# EAGLE design dsPIC (EAGLE 7.2.0)
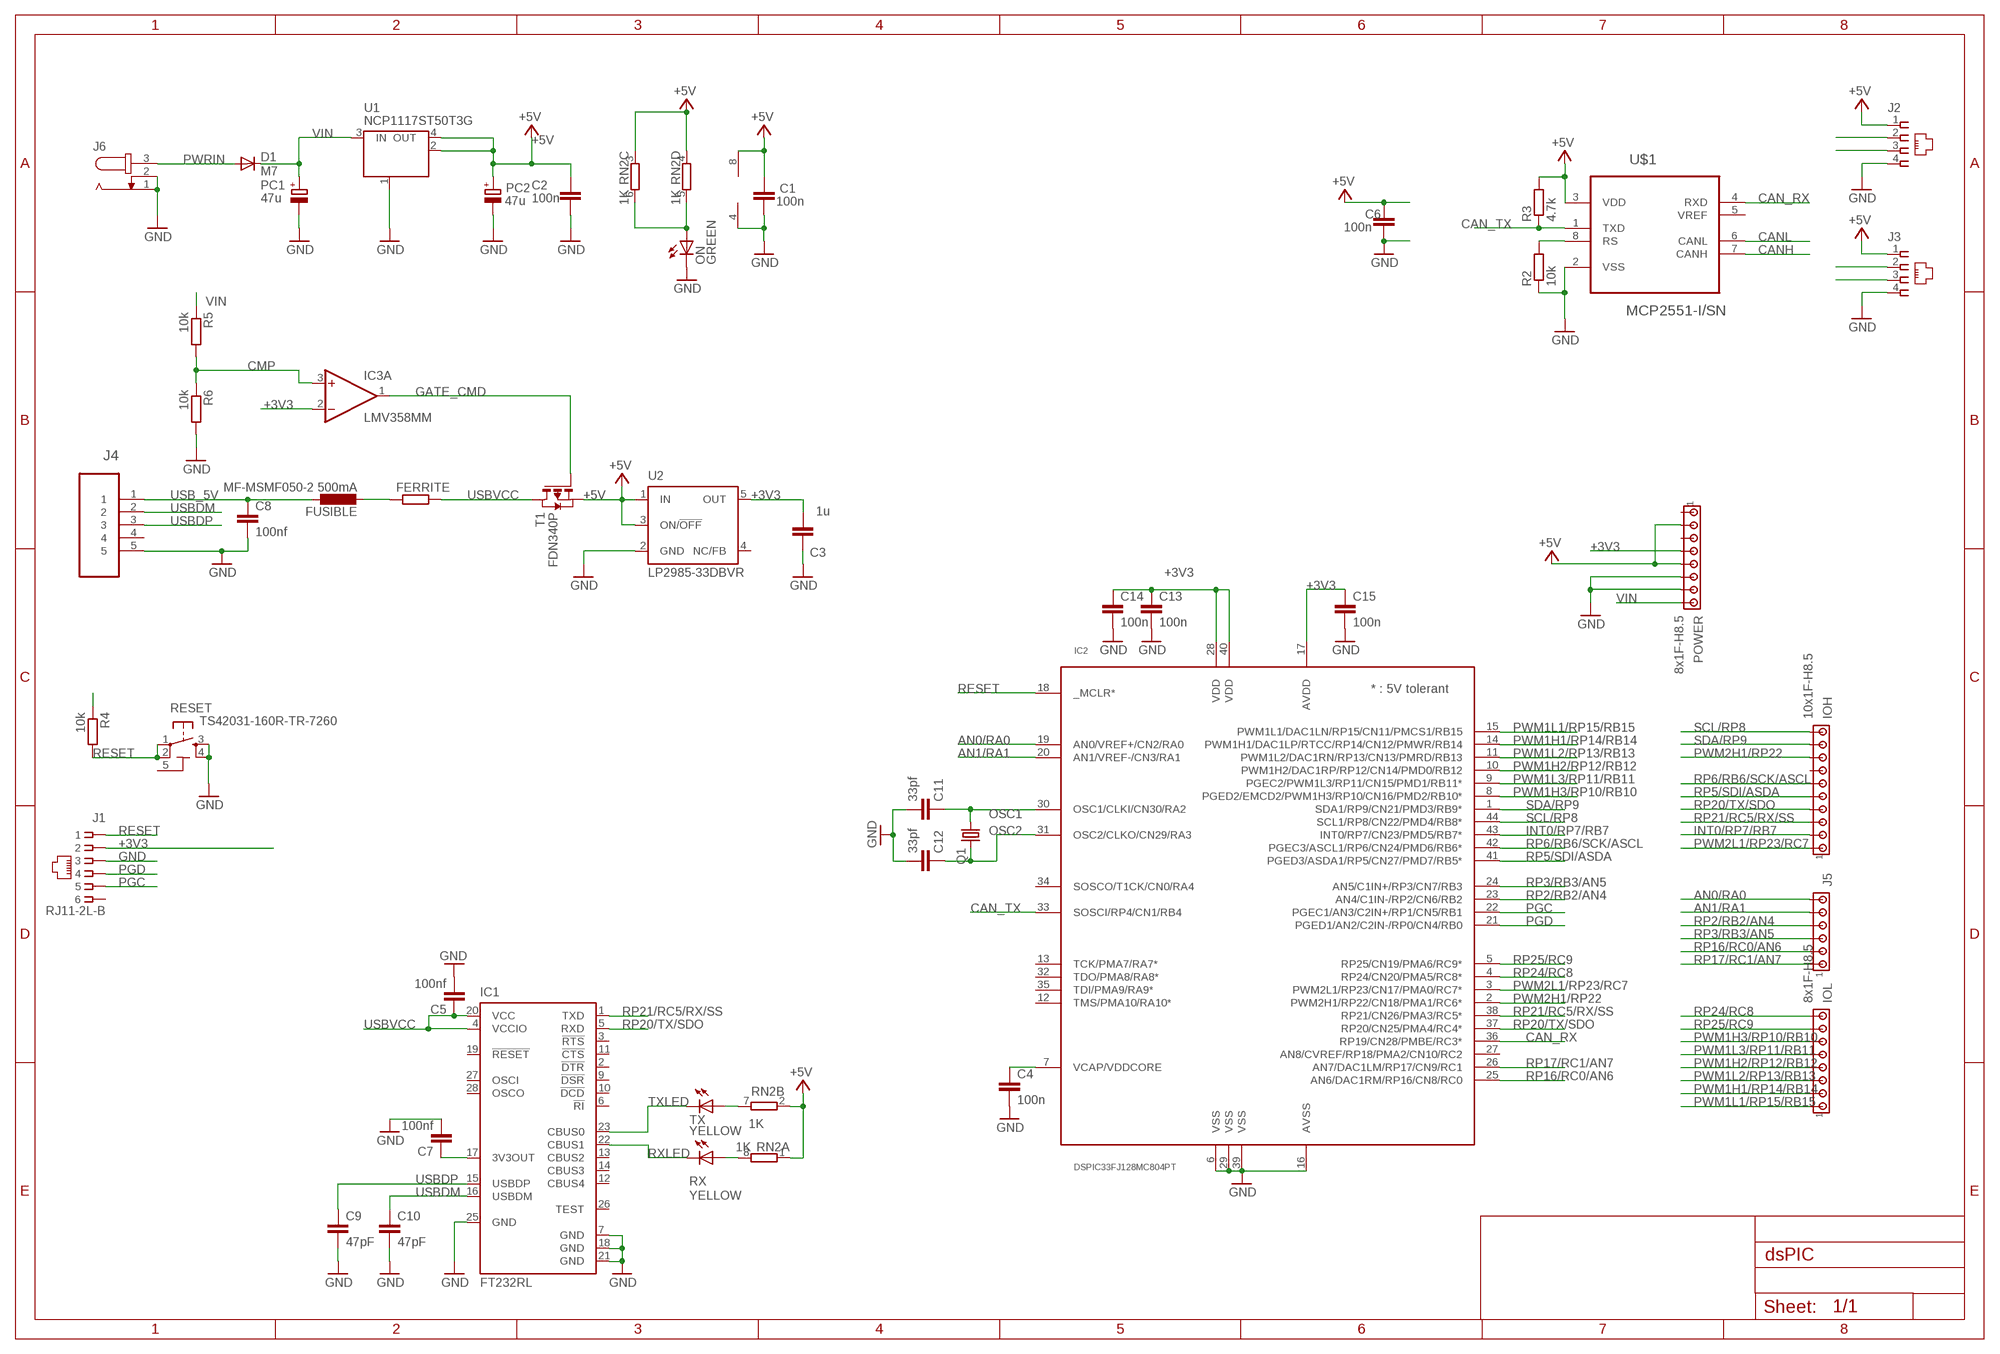
[diagram p0: schematic, sheet 1]

## Parts
C1  100n  C-EU0603-RND  [C0603-ROUND]
C2  100n  C-EU0603-RND  [C0603-ROUND]
C3  1u  C-EU0603-RND  [C0603-ROUND]
C4  100n  C-EUC0603K  [C0603K]
C5  100nf  C-EUC0603  [C0603]
C6  100n  C-EUC0603K  [C0603K]
C7  100nf  C-EUC0603  [C0603]
C8  100nf  C-EUC0603  [C0603]
C9  47pF  C-EUC0603  [C0603]
C10  47pF  C-EUC0603  [C0603]
C11  33pf  C-EUC0603  [C0603]
C12  33pf  C-EUC0603  [C0603]
C13  100n  C-EUC0603  [C0603]
C14  100n  C-EUC0603  [C0603]
C15  100n  C-EUC0603  [C0603]
D1  M7  DIODE-SMB  [SMB]
FERRITE  R-EU_M0805  [M0805]
FUSIBLE  MF-MSMF050-2 500mA  L-EUL1812  [L1812]
IC1  FT232RL  [SSOP28]
IC2  DSPIC33FJ128MC804PT  [TQFP44]
IC3  LMV358MM  [MSOP08]
IOH  10x1F-H8.5  MTA10-100  [10X10MTA]
IOL  8x1F-H8.5  MTA08-100  [10X08MTA]
J1  RJ11-2L-B  [RJ11-NO_SHIELD]
J2  520249-2  [520249-2]
J3  520249-2  [520249-2]
J4  47346-0001  [MOLEX_47346-0001]
J5  MTA06-100  [10X06MTA]
J6  JACK-PLUG0  [SPC4077]
ON  GREEN  LEDCHIP-LED0805  [CHIP-LED0805]
PC1  47u  CPOL-EUD  [PANASONIC_D]
PC2  47u  CPOL-EUD  [PANASONIC_D]
POWER  8x1F-H8.5  MTA08-100  [10X08MTA]
Q1  CRYSTALSM49  [SM49]
R2  10k  R-EU_R0805  [R0805]
R3  4.7k  R-EU_R0805  [R0805]
R4  10k  R-EU_R0805  [R0805]
R5  10k  R-EU_R0805  [R0805]
R6  10k  R-EU_R0805  [R0805]
RESET  TS42031-160R-TR-7260  TS42  [TS42]
RN2  1K  4R-NCAY16  [CAY16]
RX  YELLOW  LEDCHIP-LED0805  [CHIP-LED0805]
T1  FDN340P  PMOSSOT23  [SOT-23]
TX  YELLOW  LEDCHIP-LED0805  [CHIP-LED0805]
U1  NCP1117ST50T3G  MC33269ST-3.3T3  [SOT223]
U2  LP2985-33DBVR  LP2985-XXDBVR33  [SOT23-DBV]
U$1  MCP2551-I/SN  [SOIC127P600X175-8N]

## Nets
+3V3: C3.2 C13.1 C14.1 C15.1 IC2.17(AVDD) IC2.28(VDD) IC2.40(VDD) IC3.2(A:-IN) J1.2 POWER.4 R4.1 U2.5(OUT)
+5V: C1.2 C2.2 C6.2 IC3.8(P:V+) J2.1 J3.1 PC2.+ POWER.2 POWER.5 R3.2 RN2.1 RN2.2 RN2.3 RN2.4 T1.2(S) U1.2(OUT) U1.4(OUT) U2.1(IN) U2.3(ON/!OFF) U$1.3(VDD)
AN0/RA0: IC2.19(AN0/VREF+/CN2/RA0) J5.1
AN1/RA1: IC2.20(AN1/VREF-/CN3/RA1) J5.2
CAN_RX: IC2.36(RP19/CN28/PMBE/RC3*) U$1.4(RXD)
CAN_TX: IC2.33(SOSCI/RP4/CN1/RB4) R3.1 U$1.1(TXD)
CANH: J2.2 J3.2 U$1.7(CANH)
CANL: J2.3 J3.3 U$1.6(CANL)
CMP: IC3.3(A:+IN) R5.2 R6.1
GATE_CMD: IC3.1(A:OUT) T1.3(G)
GND: C1.1 C2.1 C3.1 C4.2 C5.2 C6.1 C7.2 C8.2 C9.2 C10.2 C11.2 C12.2 C13.2 C14.2 C15.2 IC1.7(GND) IC1.18(GND) IC1.21(GND) IC1.25(GND) IC2.6(VSS) IC2.16(AVSS) IC2.29(VSS) IC2.39(VSS) IC3.4(P:V-) J1.3 J2.4 J3.4 J4.5 J6.1 J6.2 ON.C PC1.- PC2.- POWER.6 POWER.7 R2.1 R6.2 RESET.3 RESET.4 U1.1(GND/ADJ) U2.2(GND) U$1.2(VSS)
INT0/RP7/RB7: IC2.43(INT0/RP7/CN23/PMD5/RB7*) IOH.2
N$1: RN2.7 TX.A
N$2: C7.1 IC1.17(3V3OUT)
N$3: ON.A RN2.5 RN2.6
N$4: FERRITE.1 FUSIBLE.2
N$5: C4.1 IC2.7(VCAP/VDDCORE)
N$10: RN2.8 RX.A
N$11: R2.2 U$1.8(RS)
OSC1: C11.1 IC2.30(OSC1/CLKI/CN30/RA2) Q1.1
OSC2: C12.1 IC2.31(OSC2/CLKO/CN29/RA3) Q1.2
PGC: IC2.22(PGEC1/AN3/C2IN+/RP1/CN5/RB1) J1.5
PGD: IC2.21(PGED1/AN2/C2IN-/RP0/CN4/RB0) J1.4
PWM1H1/RP14/RB14: IC2.14(PWM1H1/DAC1LP/RTCC/RP14/CN12/PMWR/RB14) IOL.2
PWM1H2/RP12/RB12: IC2.10(PWM1H2/DAC1RP/RP12/CN14/PMD0/RB12) IOL.4
PWM1H3/RP10/RB10: IC2.8(PGED2/EMCD2/PWM1H3/RP10/CN16/PMD2/RB10*) IOL.6
PWM1L1/RP15/RB15: IC2.15(PWM1L1/DAC1LN/RP15/CN11/PMCS1/RB15) IOL.1
PWM1L2/RP13/RB13: IC2.11(PWM1L2/DAC1RN/RP13/CN13/PMRD/RB13) IOL.3
PWM1L3/RP11/RB11: IC2.9(PGEC2/PWM1L3/RP11/CN15/PMD1/RB11*) IOL.5
PWM2H1/RP22: IC2.2(PWM2H1/RP22/CN18/PMA1/RC6*) IOH.8
PWM2L1/RP23/RC7: IC2.3(PWM2L1/RP23/CN17/PMA0/RC7*) IOH.1
PWRIN: D1.A J6.3
RESET: IC2.18(_MCLR*) J1.1 R4.2 RESET.1 RESET.2
RP2/RB2/AN4: IC2.23(AN4/C1IN-/RP2/CN6/RB2) J5.3
RP3/RB3/AN5: IC2.24(AN5/C1IN+/RP3/CN7/RB3) J5.4
RP5/SDI/ASDA: IC2.41(PGED3/ASDA1/RP5/CN27/PMD7/RB5*) IOH.5
RP6/RB6/SCK/ASCL: IC2.42(PGEC3/ASCL1/RP6/CN24/PMD6/RB6*) IOH.6
RP16/RC0/AN6: IC2.25(AN6/DAC1RM/RP16/CN8/RC0) J5.5
RP17/RC1/AN7: IC2.26(AN7/DAC1LM/RP17/CN9/RC1) J5.6
RP20/TX/SDO: IC1.5(RXD) IC2.37(RP20/CN25/PMA4/RC4*) IOH.4
RP21/RC5/RX/SS: IC1.1(TXD) IC2.38(RP21/CN26/PMA3/RC5*) IOH.3
RP24/RC8: IC2.4(RP24/CN20/PMA5/RC8*) IOL.8
RP25/RC9: IC2.5(RP25/CN19/PMA6/RC9*) IOL.7
RXLED: IC1.22(CBUS1) RX.C
SCL/RP8: IC2.44(SCL1/RP8/CN22/PMD4/RB8*) IOH.10
SDA/RP9: IC2.1(SDA1/RP9/CN21/PMD3/RB9*) IOH.9
TXLED: IC1.23(CBUS0) TX.C
USB_5V: C8.1 FUSIBLE.1 J4.1
USBDM: C10.1 IC1.16(USBDM) J4.2
USBDP: C9.1 IC1.15(USBDP) J4.3
USBVCC: C5.1 FERRITE.2 IC1.4(VCCIO) IC1.20(VCC) T1.1(D)
VIN: D1.C PC1.+ POWER.8 R5.1 U1.3(IN)
Unconnected: IC1.2(!DTR) IC1.3(!RTS) IC1.6(!RI) IC1.9(!DSR) IC1.10(!DCD) IC1.11(!CTS) IC1.12(CBUS4) IC1.13(CBUS2) IC1.14(CBUS3) IC1.19(!RESET) IC1.26(TEST) IC1.27(OSCI) IC1.28(OSCO) IC2.12(TMS/PMA10/RA10*) IC2.13(TCK/PMA7/RA7*) IC2.27(AN8/CVREF/RP18/PMA2/CN10/RC2) IC2.32(TDO/PMA8/RA8*) IC2.34(SOSCO/T1CK/CN0/RA4) IC2.35(TDI/PMA9/RA9*) IC3.5(B:+IN) IC3.6(B:-IN) IC3.7(B:OUT) IOH.7 J1.6 J4.4 POWER.1 POWER.3 U2.4(NC/FB) U$1.5(VREF)

## Power pins joined to a net without a drawn wire
5-GND: RESET.5(5-GND)

## Library data of the parts
C1 C2 C4 C6 = SmartPrj:C-EU: CAPACITOR, European symbol; OC_FARNELL: 2210925
C3 = SmartPrj:C-EU: CAPACITOR, European symbol; OC_FARNELL: 2346901
C5 C7 C8 C13-C15 = LibPerso:C-EU: CAPACITOR, European symbol; OC_FARNELL: 2210925
C9 C10 = LibPerso:C-EU: CAPACITOR, European symbol; OC_FARNELL: 1740601
C11 C12 = LibPerso:C-EU: CAPACITOR, European symbol; OC_FARNELL: 1740598
D1 = diode:DIODE-: DIODE; OC_FARNELL: 1858651
FERRITE = LibPerso:R-EU_: RESISTOR, European symbol; OC_FARNELL: 2292459
FUSIBLE = rcl:L-EU: INDUCTOR, European symbol; OC_FARNELL: 2396061
IC1 = ftdichip:FT232R: Source: http://www.ftdichip.com/Documents/DataSheets/DS_FT232R_v104.pdf; MPN: FT232RL; OC_FARNELL: 1146032; OC_NEWARK: 91K9918
IC2 = microchip-dspic33:DSPIC33F*04
IC3 = linear:LMV358?*: Dual General Purpose, Low Voltage, Rail-to-Rail Output Operational Amplifiers Source: http://www.national.com/mpf/LM/LMV321.html http://www.national.com/dt/lmv_qual.pdf
IOH = LibPerso:MTA10-100: AMP connector; OC_FARNELL: 1593464
IOL POWER = LibPerso:MTA08-100: AMP connector; OC_FARNELL: 1593463
J1 = LibPerso:RJ11: CORCOM Modular RJ Jacks No Shield Source: www.tycoelectronics.com .. ENG_DS_1654001_1099_RJ_L_0507.pdf; MF: TYCO ELECTRONICS; MPN: RJ11-2L-B; OC_FARNELL: 1393306; OC_NEWARK: 83F4463
J2 J3 = LibPerso:520249-2: AMP connector; OC_FARNELL: 1137972; OC_RS: 477-359
J4 = Molex-47346-0001:47346-0001: CONN RCPT 5POS MICRO USB R/A SMD; MPN: 47346-0001; OC_FARNELL: 1568026; OC_NEWARK: 47M0505; PACKAGE: 5 POS MICRO USB R/A; SUPPLIER: MOLEX
J5 = LibPerso:MTA06-100: AMP connector; OC_FARNELL: 1593462
J6 = LibPerso:JACK-PLUG: DC POWER JACK Power Jack, DC, Right Angle, Through Hole, Rated 5A at 16VDC, PC Terminals Distributor: Farnell (www.Farnell.de) Drawing: 84N1161.pdf / 84N1162.pdf Manufacturer: SPC Technology (www.spctechnology.com) Type: SPC4077 / SPC 4078; OC_FARNELL: 1737246; OC_NEWARK: unknown
ON = led:LED: LED OSRAM: - CHIPLED LG R971, LG N971, LY N971, LG Q971, LY Q971, LO R971, LY R971 LH N974, LH R974 LS Q976, LO Q976, LY Q976 LO Q996 - Hyper CHIPLED LW Q18S LB Q993, LB Q99A, LB R99A - SideLED LS A670, LO A670, LY A670, LG A670, LP A670 LB A673, LV A673, LT A673, LW A673 LH A674 LY A675 LS A676, LA A676, LO A676, LY A676, LW A676 LS A679, LY A679, LG A679 - Hyper Micro SIDELED® LS Y876, LA Y876, LO Y876, LY Y876 LT Y87S - SmartLED LW L88C, LW L88S LB L89C, LB L89S, LG L890 LS L89K, LO L89K, LY L89K LS L896, LA L896, LO L896, LY L896 - TOPLED LS T670, LO T670, LY T670, LG T670, LP T670 LSG T670, LSP T670, LSY T670, LOP T670, LYG T670 LG T671, LOG T671, LSG T671 LB T673, LV T673, LT T673, LW T673 LH T674 LS T676, LA T676, LO T676, LY T676, LB T676, LH T676, LSB T676, LW T676 LB T67C, LV T67C, LT T67C, LS T67K, LO T67K, LY T67K, LW E67C LS E67B, LA E67B, LO E67B, LY E67B, LB E67C, LV E67C, LT E67C LW T67C LS T679, LY T679, LG T679 LS T770, LO T770, LY T770, LG T770, LP T770 LB T773, LV T773, LT T773, LW T773 LH T774 LS E675, LA E675, LY E675, LS T675 LS T776, LA T776, LO T776, LY T776, LB T776 LHGB T686 LT T68C, LB T68C - Hyper Mini TOPLED® LB M676 - Mini TOPLED Santana® LG M470 LS M47K, LO M47K, LY M47K Source: http://www.osram.convergy.de LUXEON: - LUMILED® LXK2-PW12-R00, LXK2-PW12-S00, LXK2-PW14-U00, LXK2-PW14-V00 LXK2-PM12-R00, LXK2-PM12-S00, LXK2-PM14-U00 LXK2-PE12-Q00, LXK2-PE12-R00, LXK2-PE12-S00, LXK2-PE14-T00, LXK2-PE14-U00 LXK2-PB12-K00, LXK2-PB12-L00, LXK2-PB12-M00, LXK2-PB14-N00, LXK2-PB14-P00, LXK2-PB14-Q00 LXK2-PR12-L00, LXK2-PR12-M00, LXK2-PR14-Q00, LXK2-PR14-R00 LXK2-PD12-Q00, LXK2-PD12-R00, LXK2-PD12-S00 LXK2-PH12-R00, LXK2-PH12-S00 LXK2-PL12-P00, LXK2-PL12-Q00, LXK2-PL12-R00 Source: www.luxeon.com KINGBRIGHT: KA-3528ASYC Source: www.kingbright.com; OC_FARNELL: 8529906
PC1 PC2 = rcl:CPOL-EU: POLARIZED CAPACITOR, European symbol; OC_FARNELL: 1850100
Q1 = crystal:CRYSTAL: CRYSTAL; OC_FARNELL: 1842332; OC_NEWARK: unknown
R2-R6 = LibPerso:R-EU_: RESISTOR, European symbol
RESET = SmartPrj:TS42: TS42 Dongnan Electronics Tact switch VDC 12V - 50mA; OC_FARNELL: 2060823
RN2 = resistor-dil:4R-N: Array Chip Resistor Source: RS Component / Phycomp; OC_FARNELL: 2352761; OC_NEWARK: none
RX TX = led:LED: LED OSRAM: - CHIPLED LG R971, LG N971, LY N971, LG Q971, LY Q971, LO R971, LY R971 LH N974, LH R974 LS Q976, LO Q976, LY Q976 LO Q996 - Hyper CHIPLED LW Q18S LB Q993, LB Q99A, LB R99A - SideLED LS A670, LO A670, LY A670, LG A670, LP A670 LB A673, LV A673, LT A673, LW A673 LH A674 LY A675 LS A676, LA A676, LO A676, LY A676, LW A676 LS A679, LY A679, LG A679 - Hyper Micro SIDELED® LS Y876, LA Y876, LO Y876, LY Y876 LT Y87S - SmartLED LW L88C, LW L88S LB L89C, LB L89S, LG L890 LS L89K, LO L89K, LY L89K LS L896, LA L896, LO L896, LY L896 - TOPLED LS T670, LO T670, LY T670, LG T670, LP T670 LSG T670, LSP T670, LSY T670, LOP T670, LYG T670 LG T671, LOG T671, LSG T671 LB T673, LV T673, LT T673, LW T673 LH T674 LS T676, LA T676, LO T676, LY T676, LB T676, LH T676, LSB T676, LW T676 LB T67C, LV T67C, LT T67C, LS T67K, LO T67K, LY T67K, LW E67C LS E67B, LA E67B, LO E67B, LY E67B, LB E67C, LV E67C, LT E67C LW T67C LS T679, LY T679, LG T679 LS T770, LO T770, LY T770, LG T770, LP T770 LB T773, LV T773, LT T773, LW T773 LH T774 LS E675, LA E675, LY E675, LS T675 LS T776, LA T776, LO T776, LY T776, LB T776 LHGB T686 LT T68C, LB T68C - Hyper Mini TOPLED® LB M676 - Mini TOPLED Santana® LG M470 LS M47K, LO M47K, LY M47K Source: http://www.osram.convergy.de LUXEON: - LUMILED® LXK2-PW12-R00, LXK2-PW12-S00, LXK2-PW14-U00, LXK2-PW14-V00 LXK2-PM12-R00, LXK2-PM12-S00, LXK2-PM14-U00 LXK2-PE12-Q00, LXK2-PE12-R00, LXK2-PE12-S00, LXK2-PE14-T00, LXK2-PE14-U00 LXK2-PB12-K00, LXK2-PB12-L00, LXK2-PB12-M00, LXK2-PB14-N00, LXK2-PB14-P00, LXK2-PB14-Q00 LXK2-PR12-L00, LXK2-PR12-M00, LXK2-PR14-Q00, LXK2-PR14-R00 LXK2-PD12-Q00, LXK2-PD12-R00, LXK2-PD12-S00 LXK2-PH12-R00, LXK2-PH12-S00 LXK2-PL12-P00, LXK2-PL12-Q00, LXK2-PL12-R00 Source: www.luxeon.com KINGBRIGHT: KA-3528ASYC Source: www.kingbright.com; OC_FARNELL: 1686073
T1 = zetex:PMOSSOT23: MOS FET; OC_FARNELL: 9846310; OC_NEWARK: none
U1 = linear:MC33269ST*: Adjustable Output Low Dropout Voltage Regulator 800 mA Source: http://www.onsemi.com/pub/Collateral/MC33269-D.PDF; OC_FARNELL: 2112617
U2 = SmartPrj:LP2985-XXDBVR: ULTRALOW-POWER 50-mA LOW-DROPOUT LINEAR REGULATORS 50-mA Low-Dropout Regulator Source: http://focus.ti.com/lit/ds/symlink/tps77001.pdf; OC_FARNELL: 2395925
U$1 = LibPerso:MCP2551-I/SN: High-Speed CAN Transceiver; MPN: MCP2551-I/SN; OC_FARNELL: 9758569; OC_NEWARK: 69K7604; PACKAGE: SOIC-8; SUPPLIER: Microchip

## Net classes
0 default: width 0.254 mm, clearance 0.254 mm
1 power: width 0.61 mm, drill 0.61 mm, clearance 0.254 mm
2 gnd: width 0.305 mm, drill 0.559 mm, clearance 0.254 mm
3 usbvcc: width 0.508 mm, drill 0.61 mm, clearance 0.254 mm
4 aref: width 0.406 mm, drill 0.61 mm, clearance 0.254 mm

## Board
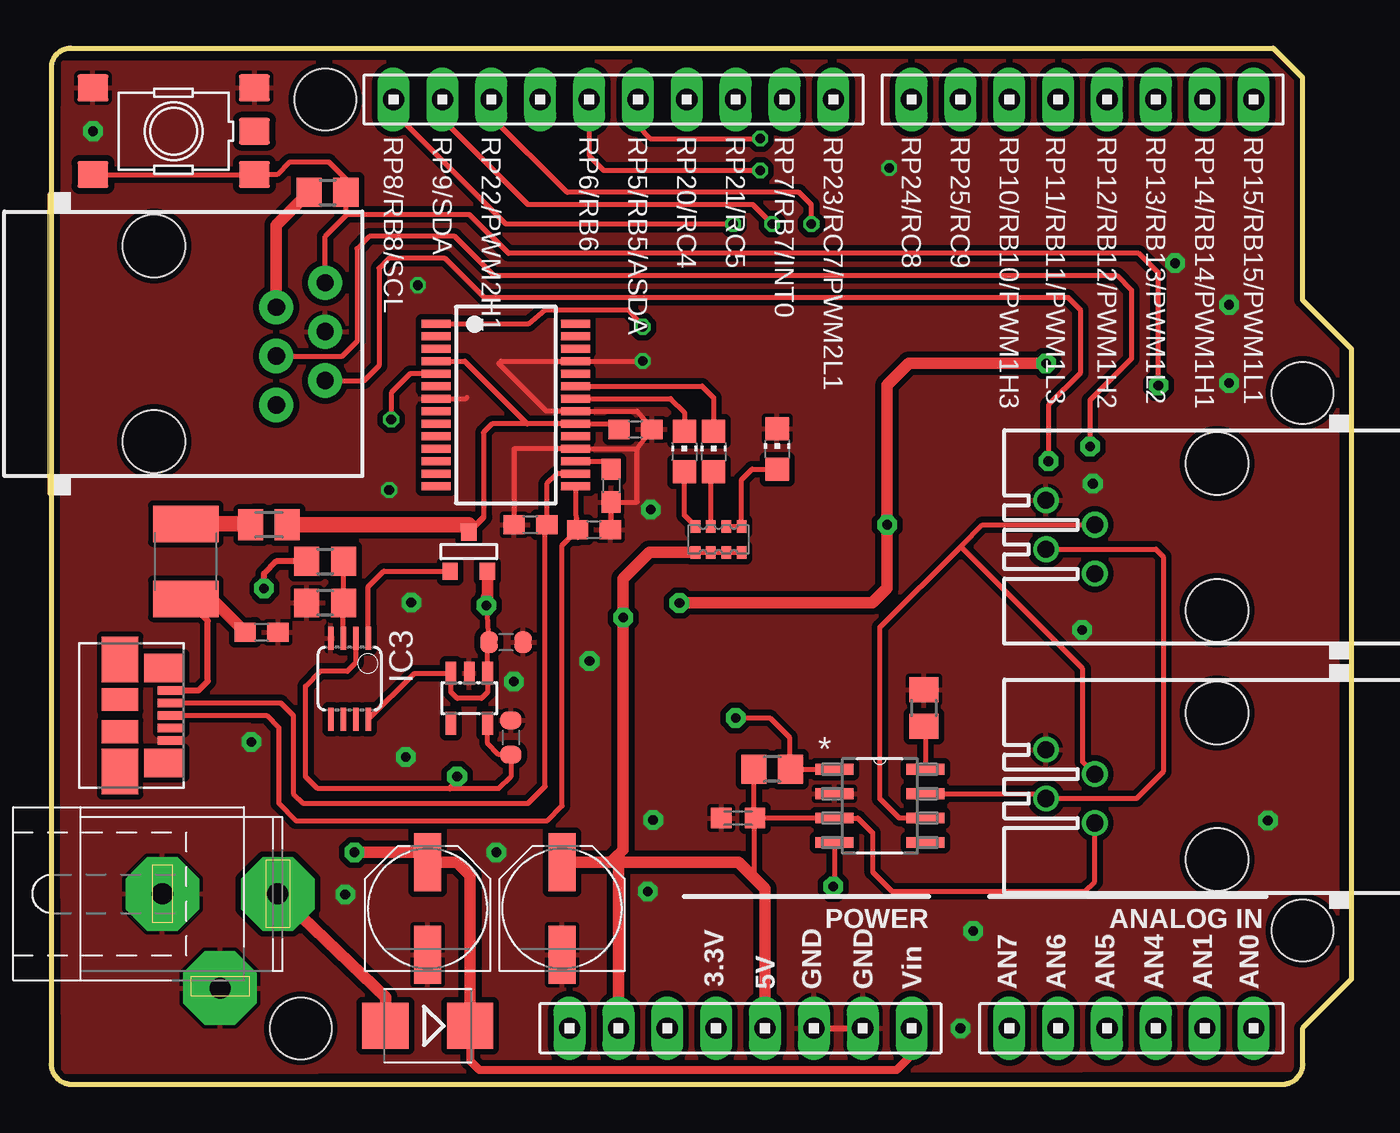
[diagram p1: board, top side]
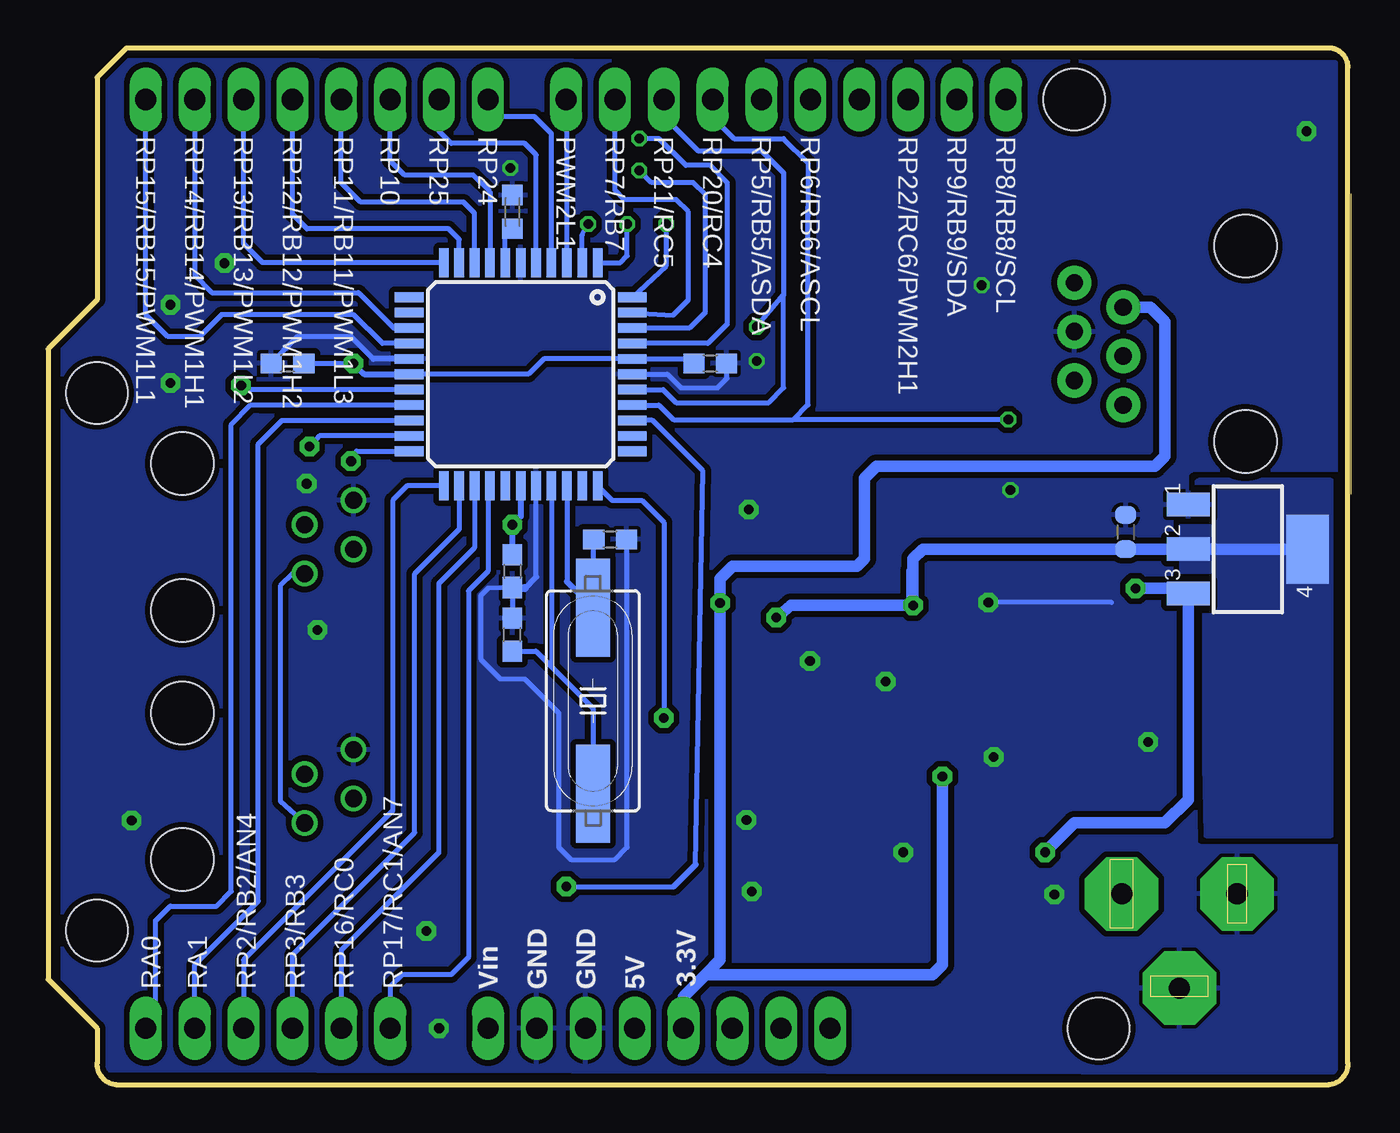
[diagram p2: board, bottom side, seen from below]

Size 67.57 x 53.85 mm. Coordinates in mm from the lower left corner, seen from the top.
Outline: 63.5,53.85 65.03,52.32 65.03,40.77 67.57,38.23 67.57,5.46 65.03,2.92 65.03,1.13 arc-90 64.03,0 1,0 arc-90 0,1.13 0,52.85 arc-90 1,53.85 63.5,53.85
Copper layers (1*16): Top 0.018mm / dielectric 1.55mm / Bottom 0.018mm
Design rules "eC_2Layer_PClass6_BaseCopperO18_eCDefault": minimum track width 0.15mm, minimum drill 0.35mm, track to track 0.15mm, track to pad 0.15mm, pad to pad 0.15mm, via to via 0.15mm, smd to smd 0mil, copper to edge 0.25mm, drill to drill 0.35mm, minimum pad ring 0.175mm, minimum via ring 0.125mm, stop-mask expansion 0mil, vias tented up to drill 0.45mm, thermal gap 0.2mm
Holes 3.2 mm at 65.03,35.94 65.03,8 14.23,51.18 12.96,2.92
vRestrict: area 47.8,10.3 to 48.4,10.8; area 50.3,10.2 to 50.8,11

### Footprints (pad centres in the part's own frame; a part is rotated, then mirrored left to right if it is on the bottom)
C0603-ROUND = smd 0.898 x 1.1: 1 -0.889,0; 2 0.889,0
C0603K = smd 1.05 x 1.08: 1 -0.875,0; 2 0.875,0
C0603 = smd 1.1 x 1: 1 -0.85,0; 2 0.85,0
SMB = smd 2.4 x 2.4: A 2.2,0; C -2.2,0
M0805 = smd 1.3 x 1.6: 1 -0.95,0; 2 0.95,0
L1812 = smd 1.9 x 3.4: 1 -1.95,0; 2 1.95,0
SSOP28 = smd 0.4 x 1.5: 1 -4.225,-3.625; 2 -3.575,-3.625; 3 -2.925,-3.625; 4 -2.275,-3.625; 5 -1.625,-3.625; 6 -0.975,-3.625; 7 -0.325,-3.625; 8 0.325,-3.625; 9 0.975,-3.625; 10 1.625,-3.625; 11 2.275,-3.625; 12 2.925,-3.625; 13 3.575,-3.625; 14 4.225,-3.625; 15 4.225,3.625; 16 3.575,3.625; 17 2.925,3.625; 18 2.275,3.625; 19 1.625,3.625; 20 0.975,3.625; 21 0.325,3.625; 22 -0.325,3.625; 23 -0.975,3.625; 24 -1.625,3.625; 25 -2.275,3.625; 26 -2.925,3.625; 27 -3.575,3.625; 28 -4.225,3.625
TQFP44 = smd 1.5 x 0.5: 1 -5.8,4; 2 -5.8,3.2; 3 -5.8,2.4; 4 -5.8,1.6; 5 -5.8,0.8; 6 -5.8,0; 7 -5.8,-0.8; 8 -5.8,-1.6; 9 -5.8,-2.4; 10 -5.8,-3.2; 11 -5.8,-4; 23 5.8,-4; 24 5.8,-3.2; 25 5.8,-2.4; 26 5.8,-1.6; 27 5.8,-0.8; 28 5.8,0; 29 5.8,0.8; 30 5.8,1.6; 31 5.8,2.4; 32 5.8,3.2; 33 5.8,4 | smd 0.5 x 1.5: 12 -4,-5.8; 13 -3.2,-5.8; 14 -2.4,-5.8; 15 -1.6,-5.8; 16 -0.8,-5.8; 17 0,-5.8; 18 0.8,-5.8; 19 1.6,-5.8; 20 2.4,-5.8; 21 3.2,-5.8; 22 4,-5.8; 34 4,5.8; 35 3.2,5.8; 36 2.4,5.8; 37 1.6,5.8; 38 0.8,5.8; 39 0,5.8; 40 -0.8,5.8; 41 -1.6,5.8; 42 -2.4,5.8; 43 -3.2,5.8; 44 -4,5.8
MSOP08 = smd 0.3 x 1.2: 1 -0.976,-2.113; 2 -0.326,-2.113; 3 0.324,-2.113; 4 0.974,-2.113; 5 0.974,2.112; 6 0.324,2.112; 7 -0.326,2.112; 8 -0.976,2.112
10X10MTA = drill 1.1 long: 1 11.43,0; 2 8.89,0; 3 6.35,0; 4 3.81,0; 5 1.27,0; 6 -1.27,0; 7 -3.81,0; 8 -6.35,0; 9 -8.89,0; 10 -11.43,0
10X08MTA = drill 1.1 long: 1 8.89,0; 2 6.35,0; 3 3.81,0; 4 1.27,0; 5 -1.27,0; 6 -3.81,0; 7 -6.35,0; 8 -8.89,0
RJ11-NO_SHIELD = drill 0.9 pad 1.778: 1 -3.175,8.89; 2 -1.905,6.35; 3 -0.635,8.89; 4 0.635,6.35; 5 1.905,8.89; 6 3.175,6.35 | hole 3.251: -5.08,0; 5.08,0
520249-2 = drill 0.889: 1 -1.905,6.35; 2 -0.635,8.89; 3 0.635,6.35; 4 1.905,8.89 | hole 3.251: -3.81,0; 3.81,0
MOLEX_47346-0001 = smd 0.45 x 1.38: 1 -1.3,0; 2 -0.65,0; 3 0,0; 4 0.65,0; 5 1.3,0 | smd 1.475 x 2.1: M1 -2.462,-0.36; M2 2.462,-0.36 | smd 2.375 x 1.9: M3 -2.913,-2.66; M6 2.913,-2.66 | smd 1.175 x 1.9: M4 -0.82,-2.66; M5 0.85,-2.66
10X06MTA = drill 1.1 long: 1 6.35,0; 2 3.81,0; 3 1.27,0; 4 -1.27,0; 5 -3.81,0; 6 -6.35,0
SPC4077 = drill 1.1 pad 3.81 octagon: 1 -3,0; 2 0,-4.9; 3 3,0
CHIP-LED0805 = smd 1.2 x 1.2: A 0,-1.05; C 0,1.05
PANASONIC_D = smd 3 x 1.4: + 2.4,0; - -2.4,0
SM49 = smd 5.08 x 1.778: 1 -4.826,0; 2 4.826,0
R0805 = smd 1.3 x 1.5: 1 -0.95,0; 2 0.95,0
TS42 = smd 1.6 x 1.4: 1 -4.2,2.25; 2 4.2,2.25; 3 -4.2,-2.25; 4 4.2,-2.25; 5 -4.2,0
CAY16 = smd 0.5 x 0.65: 1 -1.2,-0.675; 2 -0.4,-0.675; 3 0.4,-0.675; 4 1.2,-0.675; 5 1.2,0.675; 6 0.4,0.675; 7 -0.4,0.675; 8 -1.2,0.675
SOT-23 = smd 0.787 x 0.889: 1 0.025,-1.016; 2 -0.94,1.016; 3 0.991,1.016
SOT223 = smd 1.219 x 2.235: 1 -2.311,-3.099; 2 0,-3.099; 3 2.311,-3.099 | smd 3.6 x 2.2: 4 0,3.099
SOT23-DBV = smd 0.55 x 1.2: 1 -0.95,-1.3; 2 0,-1.3; 3 0.95,-1.3; 4 0.95,1.3; 5 -0.95,1.3
SOIC127P600X175-8N = smd 1.981 x 0.559: 1 -2.362,1.905; 2 -2.362,0.635; 3 -2.362,-0.635; 4 -2.362,-1.905; 5 2.362,-1.905; 6 2.362,-0.635; 7 2.362,0.635; 8 2.362,1.905

### Placement (x,y rotation side)
C1  23.62,22.99 180 top
C2  11.56,28.7 270 bottom
C3  23.88,18.03 270 top
C4  43.44,45.34 90 bottom
C5  30.35,34.04 0 top
C6  35.69,13.84 0 top
C7  29.08,31.11 270 top
C8  10.92,23.5 0 top
C9  28.2,28.83 0 top
C10  24.89,29.08 180 top
C11  43.44,23.37 90 bottom
C12  38.36,28.32 0 bottom
C13  33.15,37.47 0 bottom
C14  43.44,26.67 270 bottom
C15  55.12,37.47 180 bottom
D1  19.56,3.05 180 top
FERRITE  11.3,29.08 0 top
FUSIBLE  6.99,27.18 90 top
IC1  23.62,35.31 270 top
IC2  43,36.9 270 bottom
IC3  15.5,21.08 180 top
IOH  29.21,51.18 0 top
IOL  53.6,51.18 0 top
J1  5.34,38.48 270 top
J2  60.58,28.45 90 top
J3  60.58,15.49 90 top
J4  6.22,19.18 270 top
J5  56.14,2.92 0 top
J6  8.76,9.91 0 top
ON  37.72,33.02 0 top
PC1  19.56,9.14 90 top
PC2  26.54,9.14 90 top
POWER  35.82,2.92 180 top
Q1  39.24,19.94 90 bottom
R2  45.34,19.56 270 top
R3  37.47,16.38 180 top
R4  14.35,46.35 0 top
R5  14.23,27.18 0 top
R6  14.23,25.02 180 top
RESET  6.35,49.53 180 top
RN2  34.67,28.32 0 top
RX  32.89,32.89 0 top
T1  21.72,27.69 180 top
TX  34.42,32.89 0 top
U1  5.21,27.81 270 bottom
U2  21.72,20.07 180 top
U$1  43.05,14.48 0 top

### Tracks (layer width: path | path; a pad name or v marks a point on that pad's centre or on a via)
+3V3  (via drill 0.5 pad 1.02)
  Top 0.254: U2.5 22.67,17.72 23.24,17.14 C3.2 23.88,16 23.24,15.37 20.7,15.37 13.84,15.37 13.21,16 13.21,20.7 13.97,21.46 15.37,21.46 15.82,21.92 IC3.2
  Top 0.305: v21.08,16 21.08,15.75 20.7,15.37
  Top 0.61: v51.69,37.47 44.58,37.47 43.44,36.32 v43.44,29.08 43.44,25.78 42.67,25.02 v32.64,25.02 | R4.1 11.69,44.64 J1.2
  Bottom 0.254: C15.1 v51.69,37.47 | C13.1 34.26,37.7 IC2.40 41.8,37.7 42.6,36.9 IC2.17
  Bottom 0.305: v51.69,37.47 51.13,36.9 IC2.17 | IC2.28 43,29.52 v43.44,29.08 C14.1
  Bottom 0.61: POWER.4 34.55,4.57 33.4,5.71 | 33.4,5.71 21.59,5.71 21.08,6.22 v21.08,16 | 33.4,5.71 32.64,6.48 v32.64,25.02 32.64,26.29 32.01,26.92 25.53,26.92 25.15,27.3 25.15,31.5 24.51,32.13 10.03,32.13 9.53,32.64 9.53,39.62 10.29,40.39 J1.2
+5V  (via drill 0.5 pad 1.02)
  Top 0.254: 22.61,25.35 C1.2 22.67,23.05 U2.1 22.67,20.38 22.35,20.07 21.08,20.07 20.77,20.38 U2.3 18.87,21.37 IC3.8 | C6.2 U$1.3 41.91,13.84 42.67,13.08 42.67,11.05 43.69,10.03 53.72,10.03 54.23,10.54 J3.1 | C6.2 36.52,13.84 R3.2 | C6.2 36.51,13.84 36.51,10.73
  Top 0.305: RN2.4 RN2.3 RN2.2 RN2.1
  Top 0.61: v22.61,24.89 22.66,24.94 22.66,25.4 | 22.66,25.4 T1.2 | 22.61,25.35 22.66,25.4 | PC2.+ 29.07,11.54 | 29.07,11.54 29.47,11.94 | POWER.2 29.47,11.94 | 29.47,11.94 29.72,12.19 v29.72,24.26 29.72,26.29 31.08,27.65 RN2.1 | POWER.5 37.09,10.16 36.51,10.73 35.7,11.54 29.07,11.54
  Bottom 0.254: J2.1 54.87,26.54 55.5,25.91 55.5,14.73 J3.1
  Bottom 0.61: U1.4 U1.2 C2.2 22.1,27.81 22.61,27.3 v22.61,24.89 | 22.61,26.72 T1.2 22.66,24.94 v22.61,24.89 | v22.61,24.89 28.96,24.89 v29.72,24.26
  pour Bottom (isolate 0.406, no thermals): 0.89,31.37 7.75,31.37 8.64,30.48 8.64,26.04 7.62,25.27 7.37,12.95 0.89,12.95
AN0/RA0
  Bottom 0.254: IC2.19 55.37,35.3 | 55.37,35.3 56.52,35.3 | J5.1 61.98,3.43 61.98,8.51 61.22,9.27 58.8,9.27 58.04,10.03 58.04,34.29 57.02,35.31 55.38,35.31 55.37,35.3
AN1/RA1
  Bottom 0.254: J5.2 59.95,6.22 56.64,9.53 56.64,33.27 55.41,34.5 IC2.20
CAN_RX  (via drill 0.5 pad 1.02)
  Top 0.254: U$1.4 40.69,10.34 v40.64,10.29
  Bottom 0.254: v40.64,10.29 35.05,10.29 | 33.91,11.43 33.53,31.88 36.16,34.5 IC2.36
  Bottom 0.305: 35.05,10.29 33.91,11.43
CAN_TX  (via drill 0.5 pad 1.02)
  Top 0.254: U$1.1 R3.1 38.36,16.44 38.36,18.03 37.34,19.05 v35.56,19.05
  Bottom 0.254: IC2.33 38.25,30.35 36.7,30.35 35.56,29.21 v35.56,19.05
CANH
  Top 0.254: U$1.7 51.44,15.11 J3.2 56.39,14.86 57.79,16.26 57.79,27.43 57.41,27.81 J2.2
CANL
  Top 0.254: U$1.6 44.07,13.84 43.05,14.86 43.05,23.75 47.31,28 | 47.31,28 48.39,29.08 J2.3 | J3.3 53.6,16.76 53.6,21.59 47.31,27.88 47.31,28
CMP
  Top 0.254: R5.2 R6.1 IC3.3
GATE_CMD
  Top 0.254: IC3.1 16.47,25.87 17.27,26.67 T1.3
GND  (via drill 0.5 pad 0.81, 0.5 pad 1.02)
  Top 0.254: 27.24,37.59 IC1.25 | C9.2 29.08,29.63 C7.2 30.44,30.27 30.44,33.03 | 30.44,33.03 C5.2 30.44,34.98 IC1.21 25.73,34.98 23.24,37.47 23.36,37.58 IC1.25 | 30.44,33.03 IC1.18 24.04,33.03 C10.2 | C8.2 12.15,23.11 | IC1.7 21.54,35.63 21.59,35.69 | IC1.25 v30.72,37.58 v30.74,37.59
  Top 0.305: POWER.6 POWER.7
  Bottom 0.254: 12.3,25.04 v18.7,25.04 | 50.66,37.7 51.82,38.86 54.61,38.86 55.36,38.11 C15.2 | 42.2,26.38 IC2.29 | 37.47,28.28 37.47,12.32 38.1,11.68 40.39,11.68 41.02,12.32 41.02,19.3 42.8,21.08 44.07,21.08 45.09,22.1 45.09,25.4 44.69,25.8 C14.2 C11.2 | IC2.39 35.38,36.9 34.67,36.2 32.77,36.2 32.27,36.69 C13.2
  Bottom 0.305: IC2.16 50.66,37.7 | 42.79,25.8 42.2,26.38
  Bottom 0.406: 37.47,28.28 C12.2 | C14.2 42.79,25.8
  other vias: 58.4,42.67 19.05,41.53 30.99,10.03 23.12,12.06 2.16,49.53 24.03,20.93 10.39,17.81 61.22,40.51 47.25,2.92 18.42,17.02 15.27,9.88 63.22,13.72 53.57,23.62 61.22,36.45 17.55,30.89 27.97,22 31.14,29.87 31.27,13.74 43.54,47.62 47.91,7.98 54.13,31.22
  pour Bottom (isolate 0.305, rank 2): 0.64,53.09 66.68,53.21 66.8,53.34 66.8,0.76 0.64,0.64
  pour Top (isolate 0.305, rank 2): 0.64,53.09 66.8,53.21 66.8,0.76 0.64,0.64 0.51,30.73
  pour Top (no thermals): 1.27,12.95 1.4,31.37 10.29,31.37 10.16,12.95
INT0/RP7/RB7
  Bottom 0.254: IC2.43 35.08,39.98 34.29,40.77 34.29,45.34 34.93,45.97 37.59,45.97 38.1,46.48 IOH.2
N$1
  Top 0.254: RN2.7 34.27,31.7 TX.A
N$2
  Top 0.254: IC1.17 28.67,32.38 C7.1
N$3
  Top 0.254: RN2.6 RN2.5 35.87,31.43 36.42,31.97 ON.A
N$4
  Top 0.813: FUSIBLE.2 10.35,29.13 FERRITE.1
N$5
  Bottom 0.254: IC2.7 43.8,44.1 C4.1
N$10
  Top 0.254: RN2.8 32.89,29.57 RX.A
N$11
  Top 0.254: R2.2 45.42,18.53 U$1.8
OSC1
  Bottom 0.254: IC2.30 41.4,21.71 | 41.4,21.71 39.24,19.56 Q1.1 | C11.1 42.2,22.52 41.4,21.71
OSC2
  Bottom 0.254: C12.1 39.24,28.28 Q1.2 | IC2.31 40.6,26.12
  Bottom 0.305: 40.6,26.12 Q1.2
PGC  (via drill 0.5 pad 1.02)
  Top 0.254: J1.5 16.26,36.58 17.02,37.34 17.02,42.42 17.53,42.93 20.45,42.93 22.48,40.89 52.83,40.89 53.47,40.26 53.47,36.96 51.82,35.31 v51.82,32.38
  Bottom 0.254: v51.82,32.38 51.55,32.9 IC2.22
PGD  (via drill 0.5 pad 1.02)
  Top 0.254: J1.4 15.11,37.85 15.88,38.61 15.88,43.43 16.51,44.07 20.96,44.07 22.99,42.04 55.37,42.04 56.14,41.27 56.14,37.72 53.98,35.56 v53.98,33.15
  Bottom 0.254: IC2.21 53.47,33.7 v53.98,33.15
PWM1H1/RP14/RB14
  Bottom 0.254: IOL.2 59.95,42.04 59.06,41.15 51.44,41.15 49.59,39.3 IC2.14
PWM1H2/RP12/RB12
  Bottom 0.254: IC2.10 46.2,43.91 46.74,44.45 54.1,44.45 54.87,45.21 IOL.4
PWM1H3/RP10/RB10
  Bottom 0.254: IOL.6 49.79,48.01 49.02,47.24 45.47,47.24 44.6,46.38 IC2.8
PWM1L1/RP15/RB15
  Bottom 0.254: IOL.1 62.49,50.67 62.49,50.16 62.49,40.01 61.34,38.86 59.69,38.86 58.55,40.01 51.69,40.01 50.19,38.5 IC2.15
PWM1L2/RP13/RB13
  Bottom 0.254: IC2.11 56.42,42.7 57.41,43.69 IOL.3
PWM1L3/RP11/RB11
  Bottom 0.254: IC2.9 45.4,45.27 45.98,45.85 51.31,45.85 52.33,46.86 IOL.5
PWM2H1/RP22  (via drill 0.5 pad 0.81)
  Top 0.254: v39.5,44.7 39.5,45.72 38.86,46.35 26.8,46.35 22.86,50.29 IOH.8
  Bottom 0.254: IC2.2 39.8,44.15 v39.5,44.7
PWM2L1/RP23/RC7
  Bottom 0.254: IC2.3 40.6,51.14 IOH.1
PWRIN
  Top 0.61: D1.A 17.36,4.54 J6.3
RESET  (via drill 0.5 pad 1.02)
  Top 0.254: RESET.2 RESET.1 11.72,47.28 12.38,47.94 14.42,47.94 15.3,47.06 R4.2 15.3,45.15 | v57.53,36.32 57.53,42.16 56.52,43.18 23.75,43.18 21.72,45.21 15.37,45.21 15.3,45.15 | 15.3,45.15 14.23,44.07 J1.1
  Bottom 0.254: IC2.18 57.24,36.1 v57.53,36.32
RP2/RB2/AN4
  Bottom 0.254: IC2.23 48.91,31.1 49.66,30.35 49.66,14.22 57.41,6.48 J5.3
RP3/RB3/AN5
  Bottom 0.254: IC2.24 46.2,28.86 48.52,26.54 48.52,13.08 54.87,6.73 J5.4
RP5/SDI/ASDA  (via drill 0.5 pad 0.81)
  Top 0.254: IOH.5 30.48,49.78 31.12,49.15 v36.83,49.15
  Bottom 0.254: IC2.41 33.28,38.5 32.26,39.52 32.26,46.86 33.15,47.75 34.42,47.75 35.82,49.15 v36.83,49.15
RP6/RB6/SCK/ASCL  (via drill 0.5 pad 0.81)
  Top 0.254: IOH.6 27.94,48.26 28.7,47.5 v36.83,47.5
  Bottom 0.254: IC2.42 34.23,39.3 33.4,40.13 33.4,46.23 34.04,46.86 36.2,46.86 v36.83,47.5
RP16/RC0/AN6
  Bottom 0.254: IC2.25 45.4,27.88 47.25,26.04 47.25,12.06 52.33,6.99 J5.5
RP17/RC1/AN7
  Bottom 0.254: IC2.26 44.71,31 44.71,26.67 45.72,25.65 45.72,6.6 46.61,5.71 49.15,5.71 49.79,5.08 J5.6
RP20/TX/SDO  (via drill 0.5 pad 0.81)
  Top 0.254: IC1.5 18.64,36.93 17.65,35.94 v17.65,34.54
  Bottom 0.254: IC2.37 35.81,35.3 35.05,34.54 28.83,34.54 | 28.83,34.54 28.07,35.31 28.08,45.09 | 28.08,45.09 28.08,45.58 | v17.65,34.54 28.83,34.54 | IOH.4 33.02,50.27 31.9,49.15 29.34,49.15 28.08,47.89 28.08,45.09
RP21/RC5/RX/SS  (via drill 0.5 pad 0.81)
  Top 0.254: IC1.1 24.8,39.53 25.66,40.26 29.97,40.26 v30.74,39.37
  Bottom 0.254: IC2.38 35.6,36.1 34.93,35.43 30.1,35.43 29.34,36.2 29.34,41.02 | v30.74,39.37 29.34,41.02 | IOH.3 35.56,50.29 33.78,48.51 30.48,48.51 29.34,47.37 29.34,41.02
RP24/RC8
  Bottom 0.254: IC2.4 41.4,49.4 42.29,50.29 44.07,50.29 44.71,50.93 IOL.8
RP25/RC9
  Bottom 0.254: IC2.5 42.2,48.3 42.8,48.9 46.61,48.9 47.25,49.53 IOL.7
RXLED
  Top 0.254: 32.84,34 RX.C 32.89,34.92 32.19,35.63 IC1.22
SCL/RP8  (via drill 0.5 pad 0.81)
  Top 0.254: v35.43,44.7 23.62,44.7 17.78,50.55 IOH.10
  Bottom 0.254: IC2.44 35.43,42.55 v35.43,44.7
SDA/RP9  (via drill 0.5 pad 0.81)
  Top 0.254: v37.47,44.7 36.45,45.72 24.77,45.72 20.32,50.16 IOH.9
  Bottom 0.254: IC2.1 37.82,42.7 37.47,43.05 v37.47,44.7
TXLED
  Top 0.254: IC1.23 33.82,36.28 34.42,35.69 TX.C
USB_5V
  Top 0.305: J4.1 7.65,20.48 8.13,20.95 8.13,24.09 FUSIBLE.1
  Top 0.61: 7.16,25.4 8.17,25.4 C8.1
  Top 0.813: 7.16,25.4 FUSIBLE.1
USBDM
  Top 0.254: IC1.16 26.27,31.73 25.74,31.2 C10.1 25.66,29 25.66,15.49 24.77,14.61 13.08,14.61 12.57,15.11 12.57,19.18 11.92,19.83 J4.2
USBDP
  Top 0.254: IC1.15 27.25,29.69 27.28,29.45 | 27.28,29.45 C9.1 | 27.35,28.41 C9.1 | J4.3 11.18,19.18 11.81,18.54 11.81,14.61 12.7,13.72 25.78,13.72 26.54,14.48 26.54,28.03 C9.1 | 27.31,29.42 27.28,29.45
USBVCC
  Top 0.254: C5.1 29.21,34.33 IC1.20 24.73,34.33 | IC1.4 21.48,37.58 24.73,34.33 | 24.73,34.33 22.9,34.33 22.46,33.88 22.46,29.46
  Top 0.305: 22.46,29.46 T1.1
  Top 0.813: FERRITE.2 21.69,29.08 T1.1
VIN  (via drill 0.5 pad 1.02)
  Top 0.305: R5.1 11.69,27.18 11.05,26.54 v11.05,25.78 11.05,25.65
  Top 0.406: D1.C 21.76,1.23 22.23,0.76 43.94,0.76 44.71,1.52 POWER.8
  Top 0.61: v15.75,12.06 19.04,12.06 PC1.+ 19.57,11.56 21.08,11.56 21.76,10.88 D1.C
  Bottom 0.61: v11.05,25.78 8.59,25.78 U1.3 8.31,14.81 9.53,13.59 14.23,13.59 v15.75,12.06

### Text on the board
tNames: RP8/RB8/SCL | RP9/SDA | RP22/PWM2H1 | RP6/RB6 | RP5/RB5/ASDA | RP20/RC4 | RP21/RC5 | RP7/RB7/INT0 | RP23/RC7/PWM2L1 | RP24/RC8 | RP25/RC9 | RP10/RB10/PWM1H3 | RP11/RB11/PWM1L3 | RP12/RB12/PWM1H2 | RP13/RB13/PWM1L2 | RP14/RB14/PWM1H1 | RP15/RB15/PWM1L1 | POWER | ANALOG IN | 3.3V | 5V | GND | GND | Vin | AN7 | AN6 | AN5 | AN4 | AN1 | AN0
bNames: RP8/RB8/SCL | RP9/RB9/SDA | RP22/RC6/PWM2H1 | RP6/RB6/ASCL | RP5/RB5/ASDA | RP20/RC4 | RP21/RC5 | RP7/RB7 | PWM2L1 | RP24 | RP25 | RP10 | RP11/RB11/PWM1L3 | RP12/RB12/PWM1H2 | RP13/RB13/PWM1L2 | RP14/RB14/PWM1H1 | RP15/RB15/PWM1L1 | 3.3V | 5V | GND | GND | Vin | RP17/RC1/AN7 | RP16/RC0 | RP3/RB3 | RP2/RB2/AN4 | RA1 | RA0
214bmp: D:/SmartProjects/Snc/a4_bn_logo2.bmp